# Altium schematic sheet DC_Power_Regulation.SchDoc: STM32F446 CNC
size B; Author: AM; CompanyName: Expatria Technologies; DrawnBy: A.Marles; Engineer: AM; Organization: Expatria Technolgoies; Address1: PO Box 2084; Address3: Merritt, BC V1K 1B8; Address4: Canada; DocumentNumber: 23; SheetNumber: 20; SheetTotal: 26
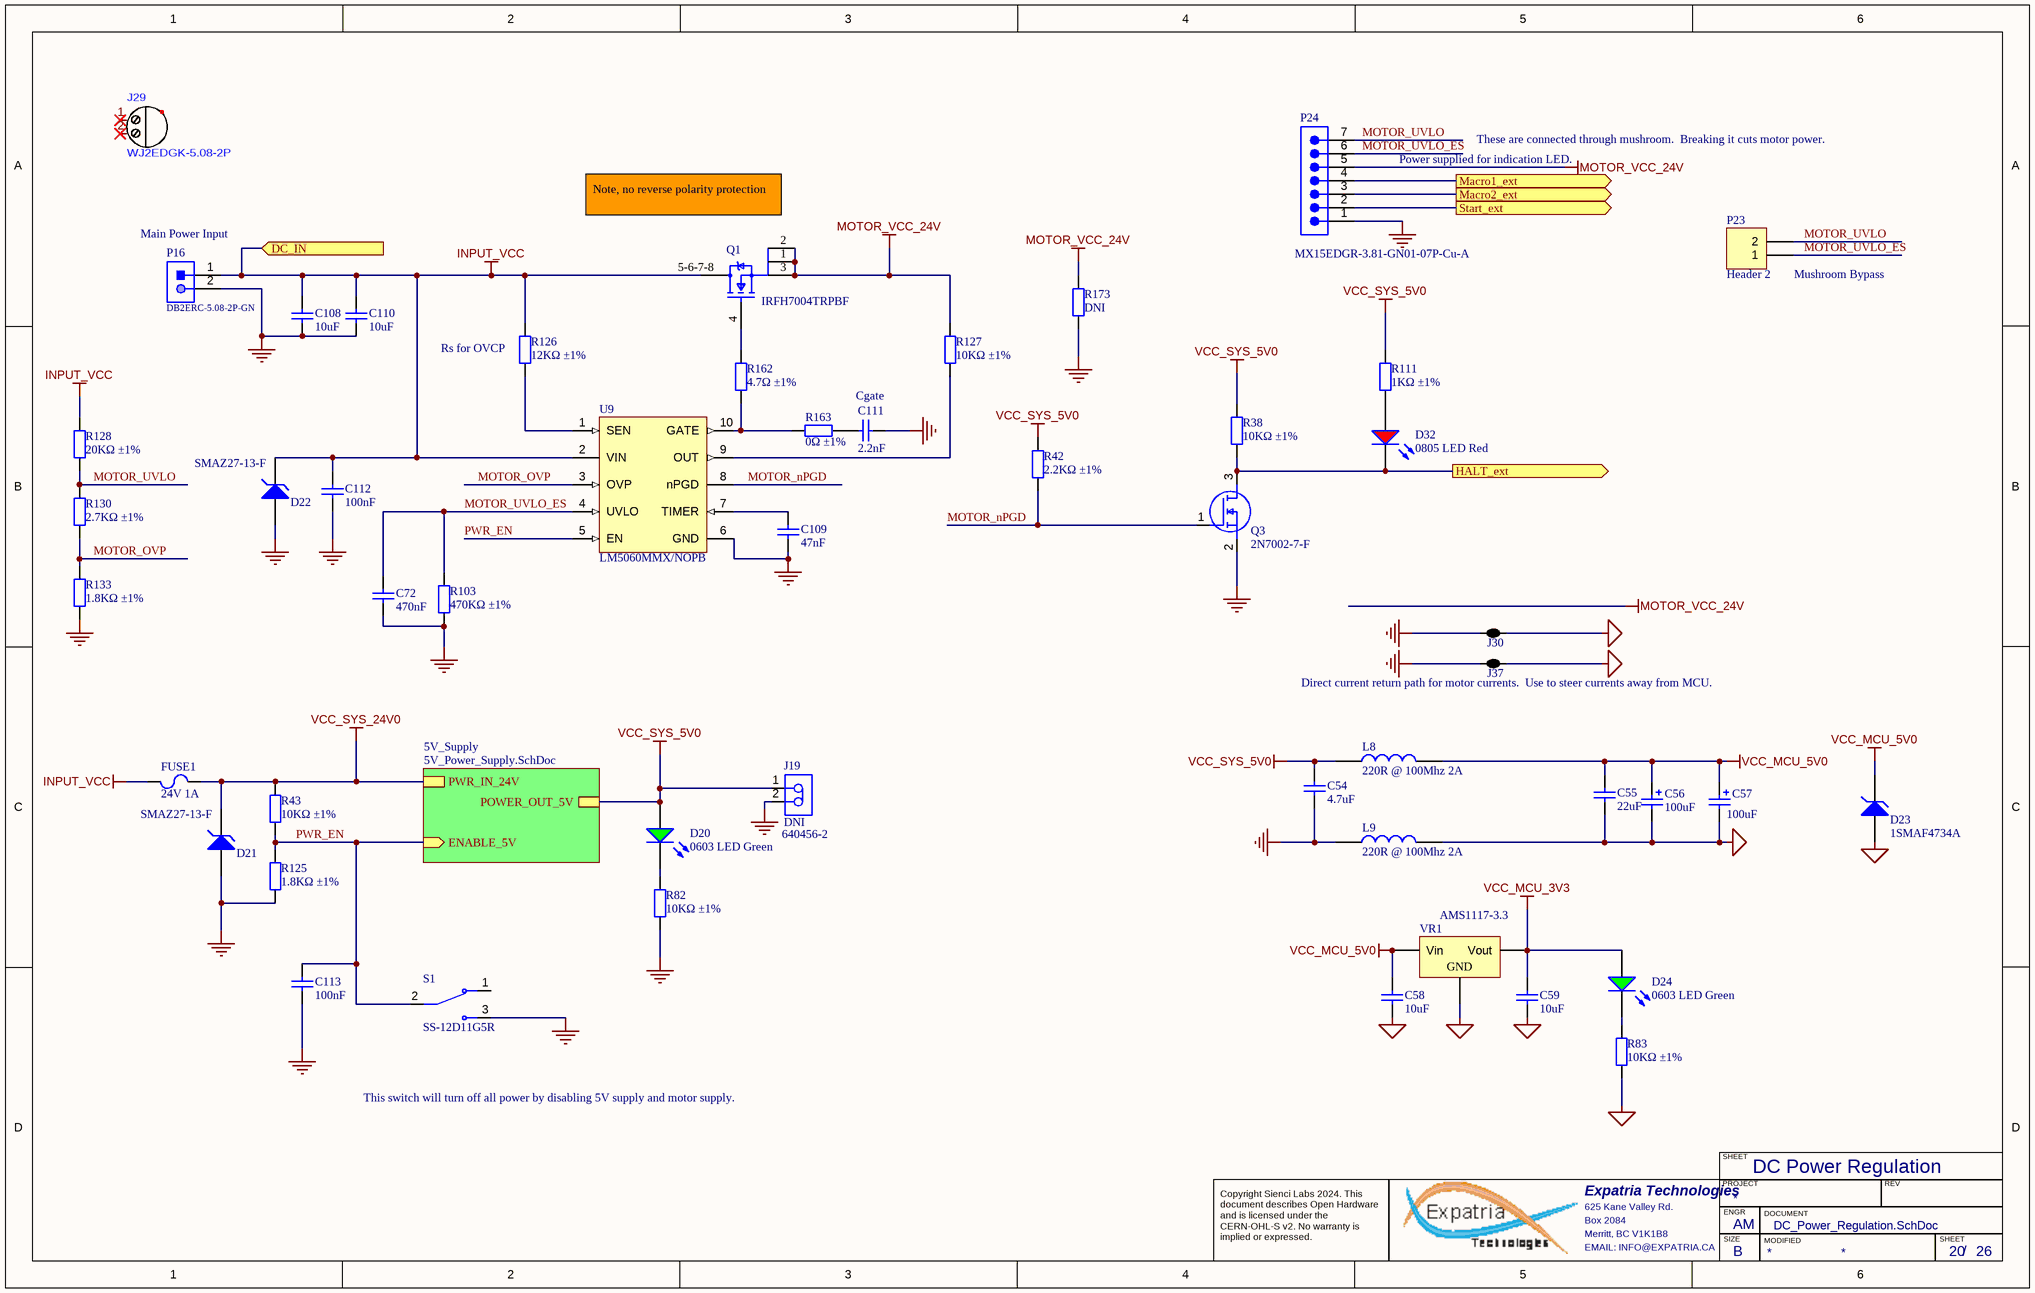
[diagram p0: DC_Power_Regulation.SchDoc]

## Parts
C54  4.7uF  [0603_C]
C55  22uF  [0805_C]
C56  100uF  [CASE-B_3528]
C57  100uF  [WCAP-ASLI_D6.3H7.7]
C58  10uF  [1206_C]
C59  10uF  [1206_C]
C72  470nF  [0603_C]
C108  10uF  [1206_C]
C109  47nF  [0603_C]
C110  10uF  [1206_C]
C111  2.2nF  [0402_C]
C112  100nF  [0603_C]
C113  100nF  [0603_C]
D20  0603 LED Green  [0603_LED_S1 - GREEN]
D21  SMAZ27-13-F  [DIOM5226X240N]
D22  SMAZ27-13-F  [DIOM5226X240N]
D23  1SMAF4734A  [DIOM5226X240N]
D24  0603 LED Green  [0603_LED_S1 - GREEN]
D32  0805 LED Red  [0805_LED_S1 - RED]
FUSE1  24V 1A  [1206_C]
J19  DNI  value 640456-2  [TECO-640456-2_V]
J29  WJ2EDGK-5.08-2P  (mechanical)
J30  2 way net tie junction  [2way_HP]  (value not drawn)  (net tie, no BOM)
J37  2 way net tie junction  [2way_HP]  (value not drawn)  (net tie, no BOM)
L8  220R @ 100Mhz 2A  [0805_R]
L9  220R @ 100Mhz 2A  [0805_R]
P16  DB2ERC-5.08-2P-GN  [CONN-TH_2P-P5.08_DB2ERC-5.08-2P]
P23  Header 2  [HDR1X2]
P24  MX15EDGR-3.81-GN01-07P-Cu-A  [691322310007]
Q1  IRFH7004TRPBF  [FP-PG-TDSON-8-MFG]
Q3  2N7002-7-F  [SOT-23(SOT-23-3)]
R38  10KΩ ±1%  [0603_R]
R42  2.2KΩ ±1%  [0603_R]
R43  10KΩ ±1%  [0603_R]
R82  10KΩ ±1%  [0603_R]
R83  10KΩ ±1%  [0603_R]
R103  470KΩ ±1%  [0603_R]
R111  1KΩ ±1%  [0603_R]
R125  1.8KΩ ±1%  [0603_R]
R126  12KΩ ±1%  [0603_R]
R127  10KΩ ±1%  [0603_R]
R128  20KΩ ±1%  [0603_R]
R130  2.7KΩ ±1%  [0603_R]
R133  1.8KΩ ±1%  [0603_R]
R162  4.7Ω ±1%  [0603_R]
R163  0Ω ±1%  [0603_R]
R173  DNI  [0603_R]  (no BOM)
S1  SS-12D11G5R  [SW_500SSP1S1M6QEA]
U9  LM5060MMX/NOPB  [DGS0010A_N]
VR1  AMS1117-3.3  [SOT-223]

## Sub-sheets
5V_Supply = 5V_Power_Supply.SchDoc: POWER_OUT_5V, PWR_IN_24V, ENABLE_5V (in)

## Ports
DC_IN (in), HALT_ext (out), Macro1_ext (out), Macro2_ext (out), Start_ext (out)

## Nets
GND: C54.1 C72.1 C108.1 C109.1 C110.1 C111.1 C112.1 C113.1 D21.1(A) D22.1(A) J19.2 J30.1 J37.1 L9.1 P16.2 P24.1 Q3.2(S) R82.1 R103.1 R125.1 R133.1 R173.1 S1.3(NO) U9.6(GND)
INPUT_VCC: C108.2 C110.2 C112.2 D22.2(K) FUSE1.1 P16.1 Q1.5-6-7-8(D) R126.2 R128.2 U9.2(VIN) ; port DC_IN
MCU_GND: C55.1 C56.2 C57.2(N) C58.1 C59.1 D23.1(A) J30.2 J37.2 L9.2 R83.1 VR1.1(GND)
MOTOR_VCC_24V: P24.5 Q1.1(S) Q1.2(S) Q1.3(S) R127.2 R173.2
VCC_MCU_3V3: C59.2 D24.A VR1.2(Vout)
VCC_MCU_5V0: C55.2 C56.1 C57.1(P) C58.2 D23.2(K) L8.2 VR1.3(Vin)
VCC_SYS_5V0: C54.2 D20.A J19.1 L8.1 R38.2 R42.2 R111.2 ; sheet 5V_Supply/POWER_OUT_5V
VCC_SYS_24V0: D21.2(K) FUSE1.2 R43.2 ; sheet 5V_Supply/PWR_IN_24V
HALT_ext: D32.K Q3.3(D) R38.1 ; port HALT_ext
Macro1_ext: P24.4 ; port Macro1_ext
Macro2_ext: P24.3 ; port Macro2_ext
MOTOR_nPGD: Q3.1(G) R42.1 U9.8(nPGD)
MOTOR_OVP: R130.1 R133.2 U9.3(OVP)
MOTOR_UVLO: P23.2 P24.7 R128.1 R130.2
MOTOR_UVLO_ES: C72.2 P23.1 P24.6 R103.2 U9.4(UVLO)
PWR_EN: C113.2 R43.1 R125.2 S1.2(COM) U9.5(EN) ; sheet 5V_Supply/ENABLE_5V
Start_ext: P24.2 ; port Start_ext
NetC109_2: C109.2 U9.7(TIMER)
NetC111_2: C111.2 R163.1
NetD20_K: D20.K R82.2
NetD24_K: D24.K R83.2
NetD32_A: D32.A R111.1
NetQ1_4: Q1.4(G) R162.2
NetR126_1: R126.1 U9.1(SEN)
NetR127_1: R127.1 U9.9(OUT)
NetR162_1: R162.1 R163.2 U9.10(GATE)

Not connected (* = marked no-connect by the designer): J29 1* 2*; S1 1(NC)

## Notes on the sheet
- Power supplied for indication LED.
- These are connected through mushroom.  Breaking it cuts motor power.
- (near P16) Main Power Input
- (near Q1) Note, no reverse polarity protection
- (near P23) Mushroom Bypass
- (near R126) Rs for OVCP
- Cgate
- (near J37) Direct current return path for motor currents.  Use to steer currents away from MCU.
- This switch will turn off all power by disabling 5V supply and motor supply.
- DC Power Regulation
- SHEET
- Expatria Technologies
- 625 Kane Valley Rd.
- Box 2084
- Merritt, BC V1K1B8
- PROJECT
- SIZE
- ENGR
- MODIFIED
- DOCUMENT
- REV
- Copyright Sienci Labs 2024. This document describes Open Hardware and is licensed under the CERN-OHL-S v2. No warranty is implied or expressed.
- EMAIL: INFO@EXPATRIA.CA
- B
- /

## Library data of the parts
C54 = 0603 4.7uF (475) 10% 16V: 16V 4.7uF X5R ±10% 0603 Multilayer Ceramic Capacitors MLCC - SMD/SMT ROHS; Manufacturer: Samsung Electro-Mechanics; Manufacturer Part Number: CL10A475KO8NNNC; ComponentLink1Description: Supplier link; ComponentLink1URL: http://www.szlcsc.com/product/details_20375.html; Package: 0603; Supplier: LC; SuppliersPartNumber: C19666; Capacitance: 4.7uF; Tolerance: 10%; Voltage: 16V
C55 = 0805 22uF (226) 20% 25V: 25V 22uF X5R ±20% 0805 Multilayer Ceramic Capacitors MLCC - SMD/SMT ROHS; Manufacturer: Samsung Electro-Mechanics; Manufacturer Part Number: CL21A226MAQNNNE; ComponentLink1Description: Supplier link; ComponentLink1URL: http://www.szlcsc.com/product/details_46786.html; Package: 0805; Supplier: LC; SuppliersPartNumber: C45783; Capacitance: 22uF; Tolerance: 20%; Voltage: 25V
C56 = 3528 100uF (107) 10% 6.3V: Tantalum capacitor; Manufacturer: AVX; PartNumber: TAJB107K006RNJ; Tolerance: 10%; Voltage: 6.3V; ComponentLink1Description: Supplier link; ComponentLink1URL: http://www.szlcsc.com/product/details_16815.html; Package: 3528; Supplier: LCSC; SuppliersPartNumber: C16133; Capacitance: 100uF; Manufacturer Part Number: TAJB107K006RNJ
C57 = 865080445010: -45℃~+105℃ 2000hrs@105℃ 100uF 7.7mm 35V 6.3mm ±20% SMD,6.3x7.7mm Aluminum Electrolytic Capacitors - SMD ROHS; Manufacturer: Capxon International Elec; Manufacturer Part Number: HV101M035E077ETR; SuppliersPartNumber: C59934; Value: 100uF; Supplier: LCSC
C58 C59 C108 C110 = 1206 10uF (106) 10% 50V: 50V 10uF X5R ±10% 1206 Multilayer Ceramic Capacitors MLCC - SMD/SMT ROHS; Manufacturer: Samsung Electro-Mechanics; Manufacturer Part Number: CL31A106KBHNNNE; Package: 1206; Supplier: LC; SuppliersPartNumber: C13585; Capacitance: 10uF; Tolerance: 10%; Voltage: 50V
C72 = 0603 470nF (474) 10% 25V: Chip capacitors; Manufacturer: Samsung Electro-Mechanics; PartNumber: CL10B474KA8NNNC; Tolerance: 10%; Voltage: 25V; ComponentLink1Description: Supplier link; ComponentLink1URL: http://www.szlcsc.com/product/details_1975.html; Package: 0603; Supplier: LC; SuppliersPartNumber: C1623; Capacitance: 470nF
C109 = 0603 47nF (473) 10% 50V: Chip capacitors; Manufacturer: Samsung Electro-Mechanics; PartNumber: CL10B473KB8NNNC; Tolerance: 10%; Voltage: 50V; ComponentLink1Description: Supplier link; ComponentLink1URL: http://www.szlcsc.com/product/details_1974.html; Package: 0603; Supplier: LC; SuppliersPartNumber: C1622; Capacitance: 47nF
C111 = 0402 2.2nF (222) 10% 50V: Chip capacitor; Manufacturer: Guangdong Fenghua Advanced Tech; PartNumber: 0402B222K500NT; Tolerance: 10%; Voltage: 50V; ComponentLink1Description: Supplier link; ComponentLink1URL: http://www.szlcsc.com/product/details_1883.html; Package: 0402; Supplier: LC; SuppliersPartNumber: C1531; Capacitance: 2.2nF
C112 C113 = 0603 100nF (104) 10% 50V: 50V 100nF X7R ±10% 0603 Multilayer Ceramic Capacitors MLCC - SMD/SMT ROHS; Manufacturer: YAGEO; Manufacturer Part Number: CC0603KRX7R9BB104; ComponentLink1Description: Supplier link; ComponentLink1URL: http://www.szlcsc.com/product/details_15331.html; Package: 0603; Supplier: LC; SuppliersPartNumber: C14663; Capacitance: 100nF; Tolerance: 10%; Voltage: 50V
D20 D24 = 19-217/GHC-YR1S2/3T: Colorless transparence -40℃~+85℃ 520nm~535nm Emerald 120° 110mW 0603 Light Emitting Diodes (LED) ROHS; Manufacturer: Everlight Elec; Package: 0603; Supplier: LC; SuppliersPartNumber: C72043; Color: Green; Manufacturer Part Number: 19-217/GHC-YR1S2/3T
D21 D22 = BZT52C27: 27V ±5% 1W 500nA @ 20.5V SMA(DO-214AC) Zener Diodes RoHS; Manufacturer: Diodes Incorporated; ComponentLink1Description: 供应商链接; ComponentLink1URL: http://www.szlcsc.com/product/details_8541.html; Package: SMA(DO-214AC); Supplier: LCSC; SuppliersPartNumber: C155318; Manufacturer Part Number: SMAZ27-13-F
D23 = BZT52C27: 27V ±5% 1W 500nA @ 20.5V SMA(DO-214AC) Zener Diodes RoHS; Manufacturer: Shandong Jingdao Microelectronics; ComponentLink1Description: 供应商链接; ComponentLink1URL: http://www.szlcsc.com/product/details_8541.html; Package: SMAF; Supplier: LCSC; SuppliersPartNumber: C169539; Manufacturer Part Number: 1SMAF4734A
D32 = 0805 LED Red: Red 0805 Light Emitting Diodes (LED) ROHS; Manufacturer: Foshan NationStar Optoelectronics; Manufacturer Part Number: NCD0805R1; Package: 0805; Supplier: LC; SuppliersPartNumber: C84256; Color: Red
FUSE1 = JK-nSMD050-24: 24V 1A 0.1s 1206 PTC Resettable Fuses RoHS; Manufacturer: Jinrui Electronic Materials Co.; Package: 1206; Supplier: LCSC; SuppliersPartNumber: C369160; PartNumber: JK-nSMD050-24; Manufacturer Part Number: JK-nSMD050-24
J19 = CMP-2000-05417-1: Male Header, Pitch 2.54 mm, 1 x 2 Position, Height 10.49 mm, Tail Length 3.556 mm, -55 to 105 degC, RoHS, Bulk; Manufacturer: TE Connectivity; Standards: RoHSCompliant,ELVCompliant,UL94V-0; Material, Housing: Polyester; Agency Approvals: CSA,UL; Brand/Series: MTA-100Series; Contact Centerline Spacing: 0.100 / in.; Material, Contact: CopperAlloy; Current, Rating: 5 / A; Color, Housing: White; Contact Termination Area Plating: Tin; Special Features: Pinstrip; Number of Positions: 2; Pin Spacing: 0.1 / "; Temperature, Operating: -55to+105 / degC; Angle: Straight; Mount Angle: Vertical; Connector Type: MTA-100; Primary Type: InterconnectSystem; Voltage, Rating: 250 / V; Mounting Hole Size: 0.04 / "; Number of Rows: 1; Termination: Solder; Length, Terminal Post: 0.14 / in.; Manufacturer URL: http://www.te.com/; Color: White; Size, Post: 0.025 / in.; Contact Shape: Square; Mounting Type: PCMount; Datasheet URL: https://datasheet.ciiva.com/11746/0900766b80eb7fdd-11746365.pdf; Type: PCBPlug; Datasheet Version: Rev. W, 06/2004; Number of Contacts: 2; Flammability Rating: UL94V-0; Contact Plating: Tin; Length, Pin: 0.14 / "; Contact Mating Area Plating: Tin; Length, Overall: 0.2 / "; SuppliersPartNumber: C86502
J29 = WJ2EDGK-5.08-2P: 5.08mm Green Plug P=5.08mm Pluggable System Terminal Block ROHS; Manufacturer: Kangnex; Supplier: LCSC; Supplier Part Number 1: C71370; Manufacturer Part Number: WJ2EDGK-5.08-2P; RoHS: No; SuppliersPartNumber: C71370
J30 J37 = 2way: ComponentLink1URL: http://www.edatools.cz/addons; ComponentLink1Description: Source; FootprintNote: LP=12mil, MP=40mil, HP=120mil
L8 L9 = CBW201209U221T: 150mΩ ±25% 220Ω@100MHz 0805 Ferrite Beads ROHS; Manufacturer: FH (Guangdong Fenghua Advanced Tech); Manufacturer Part Number: CBW201209U221T; Package: 0402; Supplier: LC; SuppliersPartNumber: C139188
P16 = DB2ERC-5.08-2P-GN: 320V 20A 2 Bend -40℃~+105℃ 1 5.08mm 1x2P Green Board Edge/Receptacle-Close Push-Pull,P=5.08mm Pluggable System Terminal Block ROHS; Manufacturer: Dibo; Supplier 1: LCSC; Supplier Part Number 1: C395737; Manufacturer Part Number: DB2ERC-5.08-2P-GN; RoHS: Yes; Category: Terminals; SuppliersPartNumber: C395737
P23 = Header 2: Straight Square Pins 2 2.54mm Black Brass 1x2P Plugin,P=2.54mm Pin Headers ROHS; Manufacturer: MOLEX; Manufacturer Part Number: 22284020; Publisher: Altium Limited; LatestRevisionDate: 17-Jul-2002; LatestRevisionNote: Re-released for DXP Platform.; SuppliersPartNumber: C234182; Supplier 1: LCSC; Supplier Part Number 1: C234182
P24 = MX15EDGR-3.81-GN01-07P-Cu-A: 300V 8A 7 Bend -40℃~+105℃ 1 3.81mm 1x7P Green Board Edge/Receptacle-Close Push-Pull,P=3.81mm Pluggable System Terminal Block ROHS; Manufacturer: MAX; Manufacturer Part Number: MX15EDGR-3.81-GN01-07P-Cu-A; SuppliersPartNumber: C5188162
Q1 = IRFH7004TRPBF: MOSFET N-CH 40V 100A 8PQFN; Rds On Max: 1.4mR; Threshold Voltage: 3V; Input Capacitance: 6.419nF; Max Power Dissipation: 156W; SuppliersPartNumber: C112334; Max Operating Temperature: 150°C; Min Operating Temperature: -55°C; Case/Package: VQFN; Packaging: Cut Tape; RoHS Compliant: Yes; Continuous Drain Current (ID): 100A; Reach SVHC Compliant: Yes; Number of Pins: 5; Mount: Surface Mount; Lead Free: Lead Free; Series: HEXFET®, StrongIRFET™; Max Dual Supply Voltage: 40V; Halogen Free: Halogen Free; Drain to Source Voltage (Vdss): 40V
Q3 = 2N7002-7-F: 60V 115mA 7.5Ω@5V,50mA 370mW N Channel SOT-23 MOSFETs ROHS; Manufacturer: Diodes Inc.; SuppliersPartNumber: C85049; Manufacturer Part Number: 2N7002-7-F; Value: 2N7002-7-F; Datasheet Link: https://datasheet.datasheetarchive.com/originals/distributors/SFDatasheet-0/sf-0003625.pdf; Height: 1.2mm; Manufacturer_Part_Number: 2N7002-7-F; Mouser Part Number: 621-2N7002-F; Mouser Price/Stock: https://www.mouser.co.uk/ProductDetail/Diodes-Incorporated/2N7002-7-F?qs=jMXWnm70%252BC%252BAX%252BMLzUkTZg%3D%3D; Arrow Part Number: 2N7002-7-F; Arrow Price/Stock: https://www.arrow.com/en/products/2n7002-7-f/diodes-incorporated?region=nac
R38 R43 R82 R83 R127 = 0603 10K (1002) 1%: Chip resistor; Manufacturer: Uniroyal Elec; PartNumber: 0603WAF1002T5E; Power: 1/10W; ComponentLink1Description: Supplier link; ComponentLink1URL: http://www.szlcsc.com/product/details_26547.html; Package: 0603; SuppliersPartNumber: C25804; Resistance: 10KΩ; Tolerance: 1%
  R38: Supplier: LC; Manufacturer Part Number: 0603WAF1002T5E
  R43 R82 R83: Supplier: LCSC; Manufacturer Part Number: 0603WAF1002T5E
  R127: Supplier: LC
R42 = 0603 2.2K (2201) 1%: Chip resistor; Manufacturer: Uniroyal Elec; PartNumber: 0603WAF2201T5E; Power: 1/10W; ComponentLink1Description: Supplier link; ComponentLink1URL: http://www.szlcsc.com/product/details_4597.html; Package: 0603; Supplier: LC; SuppliersPartNumber: C4190; Resistance: 2.2KΩ; Tolerance: 1%; Manufacturer Part Number: 0603WAF2201T5E
R103 = 0603 470K (4703) 1%: Chip resistor; Manufacturer: Uniroyal Elec; PartNumber: 0603WAF4703T5E; Power: 1/10W; ComponentLink1Description: Supplier link; ComponentLink1URL: http://www.szlcsc.com/product/details_23905.html; Package: 0603; Supplier: LC; SuppliersPartNumber: C23178; Resistance: 470KΩ; Tolerance: 1%
R111 = 0603 1K (1001) 1%: Chip resistor; Manufacturer: Uniroyal Elec; PartNumber: 0603WAF1001T5E; Power: 1/10W; ComponentLink1Description: Supplier link; ComponentLink1URL: http://www.szlcsc.com/product/details_21904.html; Package: 0603; Supplier: LC; SuppliersPartNumber: C21190; Resistance: 1KΩ; Tolerance: 1%; Manufacturer Part Number: 0603WAF1001T5E
R125 R133 = 0603 1.8K (1801) 1%: Chip resistor; Manufacturer: Uniroyal Elec; PartNumber: 0603WAF1801T5E; Power: 1/10W; ComponentLink1Description: Supplier link; ComponentLink1URL: http://www.szlcsc.com/product/details_4584.html; Package: 0603; Supplier: LC; SuppliersPartNumber: C4177; Resistance: 1.8KΩ; Tolerance: 1%
  R125: Manufacturer Part Number: 0603WAF1801T5E
R126 = 0603 12K (1202) 1%: Chip resistor; Manufacturer: Uniroyal Elec; PartNumber: 0603WAF1202T5E; Power: 1/10W; ComponentLink1Description: Supplier link; ComponentLink1URL: http://www.szlcsc.com/product/details_23517.html; Package: 0603; Supplier: LC; SuppliersPartNumber: C22790; Resistance: 12KΩ; Tolerance: 1%
R128 = 0603 20K (2002) 1%: Chip resistor; Manufacturer: Uniroyal Elec; PartNumber: 0603WAF2002T5E; Power: 1/10W; ComponentLink1Description: Supplier link; ComponentLink1URL: http://www.szlcsc.com/product/details_4591.html; Package: 0603; Supplier: LC; SuppliersPartNumber: C4184; Resistance: 20KΩ; Tolerance: 1%
R130 = 0603 2.7K (2701) 1%: Chip resistor; Manufacturer: Uniroyal Elec; PartNumber: 0603WAF2701T5E; Power: 1/10W; ComponentLink1Description: Supplier link; ComponentLink1URL: http://www.szlcsc.com/product/details_13814.html; Package: 0603; Supplier: LC; SuppliersPartNumber: C13167; Resistance: 2.7KΩ; Tolerance: 1%
R162 = 0603 4.7R (4R70) 1%: Chip resistor; Manufacturer: Uniroyal Elec; PartNumber: 0603WAF470KT5E; Power: 1/10W; ComponentLink1Description: Supplier link; ComponentLink1URL: http://www.szlcsc.com/product/details_23891.html; Package: 0603; Supplier: LC; SuppliersPartNumber: C23164; Resistance: 4.7Ω; Tolerance: 1%; Manufacturer Part Number: 0603WAF470KT5E
R163 = 0603 0R (0R0) 1%: Chip resistor; Manufacturer: Uniroyal Elec; PartNumber: 0603WAF0000T5E; Power: 1/10W; ComponentLink1Description: Supplier link; ComponentLink1URL: http://www.szlcsc.com/product/details_21903.html; Package: 0603; Supplier: LC; SuppliersPartNumber: C21189; Resistance: 0Ω; Tolerance: 1%; Manufacturer Part Number: 0603WAF0000T5E
R173 = 0603 10K (1002) 1%: Chip resistor; Manufacturer: Uniroyal Elec; PartNumber: 0603WAF1002T5E; Power: 1/10W; Resistance: 10KΩ; Tolerance: 1%; ComponentLink1Description: Supplier link; ComponentLink1URL: http://www.szlcsc.com/product/details_26547.html; Package: 0603; Supplier: LCSC; SuppliersPartNumber: C25804; Manufacturer Part Number: 0603WAF1002T5E
S1 = SS-12D11G5R: Shrouded 5A SPDT 125V 125V 5A 10000次 Black Plugin Slide Switches ROHS; Manufacturer: XKB Connectivity; SuppliersPartNumber: C388633; Manufacturer Part Number: SS-12D11G5R
U9 = LM5060MMX/NOPB: High-Side Protection Controller with Low Quiescent Current, Standard Grade, 10-pin Mini SOIC, 3500 Reel; Manufacturer: TI National Semiconductor; PackageTopMarking: ZXTT*SXAB; High-Reliability: Y; CompType: Switcher; PartNumber: LM5060MMX/NOPB; ComponentLink1Description: Datasheet URL; ComponentLink1URL: http://www.ti.com/general/docs/lit/getliterature.tsp?genericPartNumber=LM5060&fileType=pdf; Code_JEDEC: MO-187-BA; PackageReference: DGS0010A; PowerWise: Y; PackageDescription: Mini-SO, Molded, .118 x .118 x .034in Body, 10 Lead, .0197in Pitch; RoHS: Y; PinCount: 10; Manufacturer Part Number: LM5060MMX/NOPB; SuppliersPartNumber: C2676940
VR1 = SOT-223 AMS1117-3.3: Vout=3.3V 1A 72dB@(120Hz) (LDO); Manufacturer 1: AMS; ComponentLink1Description: 供应商链接; ComponentLink1URL: http://www.szlcsc.com/product/details_6652.html; Package: SOT-223; Supplier: LCSC; SuppliersPartNumber: C6186; Manufacturer Part Number 1: AMS1117-3.3; Manufacturer: AMS; Manufacturer Part Number: AMS1117-3.3